# EAGLE schematic ModbusGateway4GWiFi (EAGLE 9.6.2)
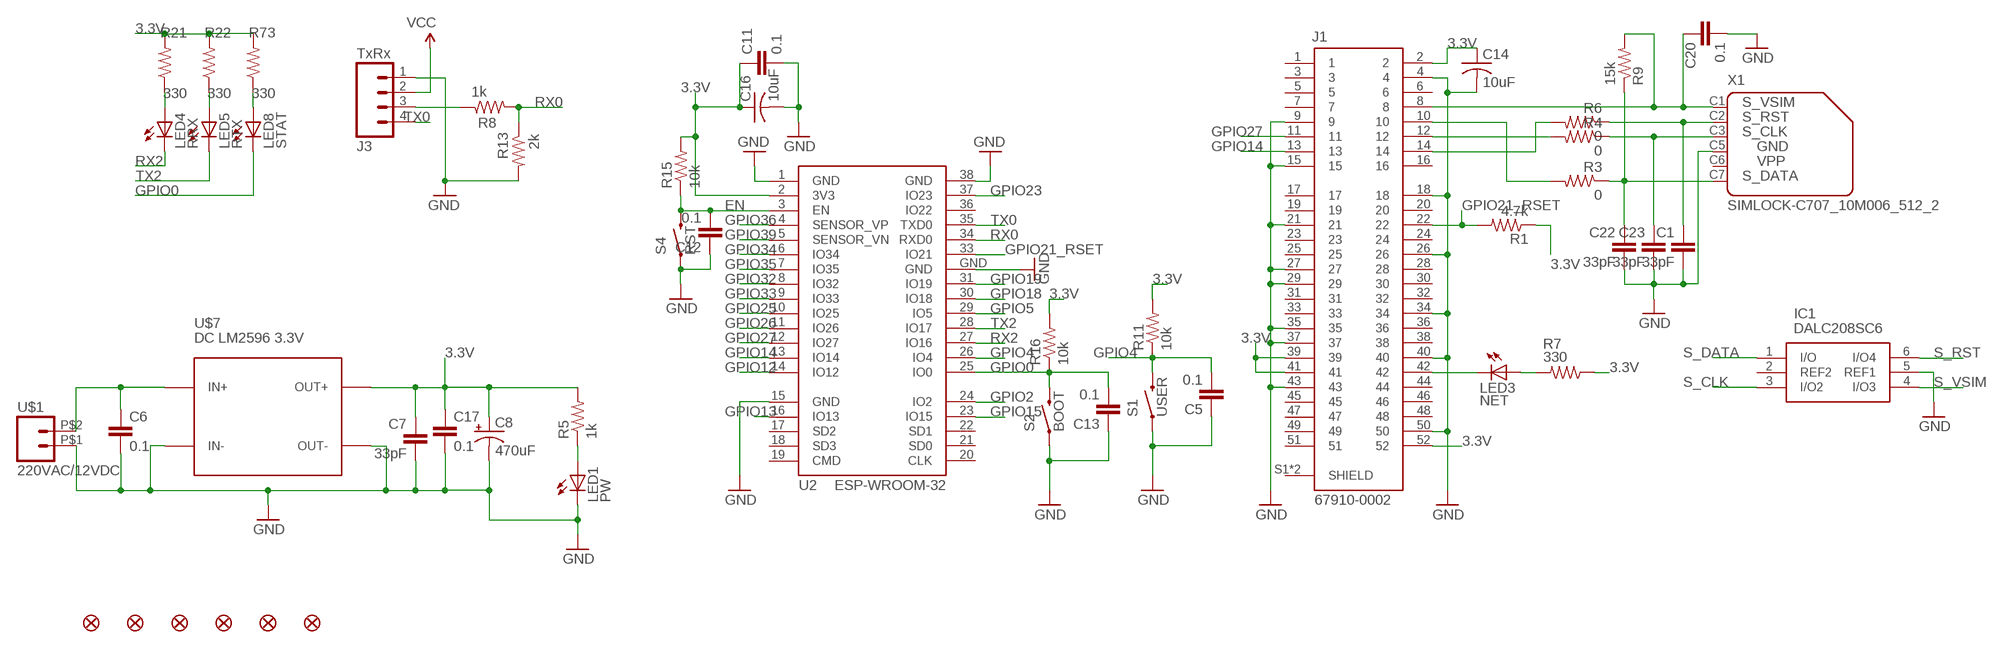
[diagram p0: schematic, sheet 1]

## Parts
C1  33pF  CAP0805  [0805]
C5  0.1  CAP0805  [0805]
C6  0.1  CAP0805  [0805]
C7  33pF  CAP0805  [0805]
C8  470uF  CPOL-US175TMP-0810  [175TMP-0810]
C11  0.1  CAP0805  [0805]
C12  0.1  CAP0805  [0805]
C13  0.1  CAP0805  [0805]
C14  10uF  C-USC1206  [C1206]
C16  10uF  C-USC1206  [C1206]
C17  0.1  CAP0805  [0805]
C20  0.1  CAP0805  [0805]
C22  33pF  CAP0805  [0805]
C23  33pF  CAP0805  [0805]
IC1  DALC208SC6  [SOT95P280X145-6N]
J1  67910-0002  [MOLEX_67910-0002]
J3  TxRx  M04POLAR  [MOLEX-1X4]
JP8  FIDUCIAL1X2  [FIDUCIAL-1X2]
JP9  FIDUCIAL1X2  [FIDUCIAL-1X2]
JP10  FIDUCIAL1X2  [FIDUCIAL-1X2]
JP11  FIDUCIAL1X2  [FIDUCIAL-1X2]
JP12  FIDUCIAL1X2  [FIDUCIAL-1X2]
JP16  FIDUCIAL1X2  [FIDUCIAL-1X2]
LED1  PW  LEDCHIP-LED0805  [CHIP-LED0805]
LED3  NET  LEDCHIP-LED0805  [CHIP-LED0805]
LED4  RRX  LEDCHIP-LED0805  [CHIP-LED0805]
LED5  RTX  LEDCHIP-LED0805  [CHIP-LED0805]
LED8  STAT  LEDCHIP-LED0805  [CHIP-LED0805]
R1  4.7k  RESISTOR0805-RES  [0805]
R3  0  RESISTOR0805-RES  [0805]
R4  0  RESISTOR0805-RES  [0805]
R5  1k  RESISTOR0805-RES  [0805]
R6  0  RESISTOR0805-RES  [0805]
R7  330  RESISTOR0805-RES  [0805]
R8  1k  RESISTOR0805-RES  [0805]
R9  15k  RESISTOR0805-RES  [0805]
R11  10k  RESISTOR0805-RES  [0805]
R13  2k  RESISTOR0805-RES  [0805]
R15  10k  RESISTOR0805-RES  [0805]
R16  10k  RESISTOR0805-RES  [0805]
R21  330  RESISTOR0805-RES  [0805]
R22  330  RESISTOR0805-RES  [0805]
R73  330  RESISTOR0805-RES  [0805]
S1  USER  SWITCH-MOMENTARY-2SMD-1101NE  [TACTILE-SWITCH-1101NE]
S2  BOOT  SWITCH-MOMENTARY-2SMD-1101NE  [TACTILE-SWITCH-1101NE]
S4  RST  SWITCH-MOMENTARY-2SMD-1101NE  [TACTILE-SWITCH-1101NE]
U2  ESP-WROOM-32  [ESP-WROOM-32]
U$1  220VAC/12VDC  5EHDRC-2P  [5EHDRC-2P]
U$7  DC LM2596 3.3V  DC-DC-STEP-DOWN-LM2596  [DC-DC-STEP-DOWN-LM2596]
X1  SIMLOCK-C707_10M006_512_2  [C707_10M006_512_2]

## Nets
3.3V: C7.1 C8.+ C11.1 C14.1 C16.1 C17.1 J1.2 J1.39 J1.41 J1.52 R1.1 R5.2 R7.1 R11.2 R15.2 R16.2 R21.2 R22.2 R73.2 U2.2(3V3) U$7.OUT+
EN: C12.2 R15.1 S4.2 U2.3(EN)
GND: C1.2 C5.1 C6.2 C7.2 C8.- C11.2 C12.1 C13.1 C14.2 C16.2 C17.2 C20.2 C22.2 C23.2 IC1.5(REF1) J1.4 J1.9 J1.15 J1.18 J1.21 J1.26 J1.27 J1.29 J1.34 J1.35 J1.37 J1.40 J1.43 J1.50 J3.1 LED1.C R13.2 S1.1 S2.1 S4.1 U2.1(GND) U2.15(GND) U2.38(GND) U2.GND U$1.P$1 U$7.IN- U$7.OUT- X1.C5
GPIO0: C13.2 LED8.C R16.1 S2.2 U2.25(IO0)
GPIO2: U2.24(IO2)
GPIO4: C5.2 R11.1 S1.2 U2.26(IO4)
GPIO5: U2.29(IO5)
GPIO12: U2.14(IO12)
GPIO13: U2.16(IO13)
GPIO14: J1.13 U2.13(IO14)
GPIO15: U2.23(IO15)
GPIO18: U2.30(IO18)
GPIO19: U2.31(IO19)
GPIO21_RSET: J1.22 R1.2 U2.33(IO21)
GPIO23: U2.37(IO23)
GPIO25: U2.10(IO25)
GPIO26: U2.11(IO26)
GPIO27: J1.11 U2.12(IO27)
GPIO32: U2.8(IO32)
GPIO33: U2.9(IO33)
GPIO34: U2.6(IO34)
GPIO35: U2.7(IO35)
GPIO36: U2.4(SENSOR_VP)
GPIO39: U2.5(SENSOR_VN)
N$1: LED1.A R5.1
N$2: C6.1 U$1.P$2 U$7.IN+
N$3: J1.10 R3.2
N$7: J1.12 R4.2
N$8: J3.3 R8.1
N$10: J1.14 R6.2
N$14: J1.42 LED3.C
N$15: LED3.A R7.2
N$48: LED4.A R21.1
N$49: LED5.A R22.1
N$54: LED8.A R73.1
RX0: R8.2 R13.1 U2.34(RXD0)
RX2: LED4.C U2.27(IO16)
S_CLK: C23.1 IC1.3(I/O2) R4.1 X1.C3
S_DATA: C22.1 IC1.1(I/O) R3.1 R9.1 X1.C7
S_RST: C1.1 IC1.6(I/O4) R6.1 X1.C2
S_VSIM: C20.1 IC1.4(I/O3) J1.8 R9.2 X1.C1
TX0: J3.4 U2.35(TXD0)
TX2: LED5.C U2.28(IO17)
VCC: J3.2
Unconnected: IC1.2(REF2) J1.1 J1.3 J1.5 J1.6 J1.7 J1.16 J1.17 J1.19 J1.20 J1.23 J1.24 J1.25 J1.28 J1.30 J1.31 J1.32 J1.33 J1.36 J1.38 J1.44 J1.45 J1.46 J1.47 J1.48 J1.49 J1.51 J1.S1(SHIELD) J1.S2(SHIELD) U2.17(SD2) U2.18(SD3) U2.19(CMD) U2.20(CLK) U2.21(SD0) U2.22(SD1) U2.36(IO22) X1.C6

## Notes on the sheet
- GND
- VPP

## Library data of the parts
C1 C5-C7 C11-C13 C17 C20 C22 C23 = SparkFun-Passives:CAP: Capacitor Standard 0603 ceramic capacitor, and 0.1" leaded capacitor.
C8 = adafruit:CPOL-US: POLARIZED CAPACITOR, American symbol
C14 C16 = adafruit:C-US: CAPACITOR, American symbol
IC1 = SamacSys_Parts:DALC208SC6: TVS Diode Array DALC208SC6 Octal, SOT-23 6-Pin Source: Datasheet <https://componentsearchengine.com/Datasheets/1/DALC208SC6.pdf>; DESCRIPTION: TVS Diode Array DALC208SC6 Octal, SOT-23 6-Pin; HEIGHT: 1.45mm; MANUFACTURER_NAME: STMicroelectronics; MANUFACTURER_PART_NUMBER: DALC208SC6; MOUSER_PART_NUMBER: 511-DALC208SC6; MOUSER_PRICE-STOCK: https://www.mouser.com/Search/Refine.aspx?Keyword=511-DALC208SC6
J1 = 67910-0002:67910-0002: 52 Position Female Connector PCI Express Mini Card Gold 0.031" (0.80mm) Black Check prices <https://pricing.snapeda.com/parts/67910-0002/Molex/view-part?ref=eda>; AVAILABILITY: Warning; DESCRIPTION: 52 Position Female Connector PCI Express Mini Card Gold 0.031 (0.80mm) Black; MF: Molex; MP: 67910-0002; PACKAGE: None; PRICE: None; PURCHASE-URL: https://pricing.snapeda.com/search/part/67910-0002/?ref=eda
J3 = SparkFun-Connectors:M04: Header 4 Standard 4-pin 0.1" header. Use with straight break away headers (SKU : PRT-00116), right angle break away headers (PRT-00553), swiss pins (PRT-00743), machine pins (PRT-00117), and female headers (PRT-00115). Molex polarized connector foot print use with SKU : PRT-08231 with associated crimp pins and housings. 1MM SMD Version SKU: PRT-10208
JP8-JP12 JP16 = SparkFun:FIDUCIAL: Fiducial Alignment Points Various fiducial points for machine vision alignment.
LED1 LED3-LED5 LED8 = led:LED: LED OSRAM: - CHIPLED LG R971, LG N971, LY N971, LG Q971, LY Q971, LO R971, LY R971 LH N974, LH R974 LS Q976, LO Q976, LY Q976 LO Q996 - Hyper CHIPLED LW Q18S LB Q993, LB Q99A, LB R99A - SideLED LS A670, LO A670, LY A670, LG A670, LP A670 LB A673, LV A673, LT A673, LW A673 LH A674 LY A675 LS A676, LA A676, LO A676, LY A676, LW A676 LS A679, LY A679, LG A679 - Hyper Micro SIDELED® LS Y876, LA Y876, LO Y876, LY Y876 LT Y87S - SmartLED LW L88C, LW L88S LB L89C, LB L89S, LG L890 LS L89K, LO L89K, LY L89K LS L896, LA L896, LO L896, LY L896 - TOPLED LS T670, LO T670, LY T670, LG T670, LP T670 LSG T670, LSP T670, LSY T670, LOP T670, LYG T670 LG T671, LOG T671, LSG T671 LB T673, LV T673, LT T673, LW T673 LH T674 LS T676, LA T676, LO T676, LY T676, LB T676, LH T676, LSB T676, LW T676 LB T67C, LV T67C, LT T67C, LS T67K, LO T67K, LY T67K, LW E67C LS E67B, LA E67B, LO E67B, LY E67B, LB E67C, LV E67C, LT E67C LW T67C LS T679, LY T679, LG T679 LS T770, LO T770, LY T770, LG T770, LP T770 LB T773, LV T773, LT T773, LW T773 LH T774 LS E675, LA E675, LY E675, LS T675 LS T776, LA T776, LO T776, LY T776, LB T776 LHGB T686 LT T68C, LB T68C - Hyper Mini TOPLED® LB M676 - Mini TOPLED Santana® LG M470 LS M47K, LO M47K, LY M47K Source: http://www.osram.convergy.de LUXEON: - LUMILED® LXK2-PW12-R00, LXK2-PW12-S00, LXK2-PW14-U00, LXK2-PW14-V00 LXK2-PM12-R00, LXK2-PM12-S00, LXK2-PM14-U00 LXK2-PE12-Q00, LXK2-PE12-R00, LXK2-PE12-S00, LXK2-PE14-T00, LXK2-PE14-U00 LXK2-PB12-K00, LXK2-PB12-L00, LXK2-PB12-M00, LXK2-PB14-N00, LXK2-PB14-P00, LXK2-PB14-Q00 LXK2-PR12-L00, LXK2-PR12-M00, LXK2-PR14-Q00, LXK2-PR14-R00 LXK2-PD12-Q00, LXK2-PD12-R00, LXK2-PD12-S00 LXK2-PH12-R00, LXK2-PH12-S00 LXK2-PL12-P00, LXK2-PL12-Q00, LXK2-PL12-R00 Source: www.luxeon.com KINGBRIGHT: KA-3528ASYC Source: www.kingbright.com
R1 R3-R9 R11 R13 R15 R16 R21 R22 R73 = SparkFun-Resistors:RESISTOR: Resistor Basic schematic elements and footprints for 0603, 1206, and PTH resistors.
S1 S2 S4 = SparkFun-Electromechanical:SWITCH-MOMENTARY-2: Various NO switches- pushbuttons, reed, etc; PROD_ID: SWCH-00815
U2 = esp32:ESP-WROOM-32: Espressif Systems ESP-WROOM-32
U$1 = ES-CONNECTOR:5EHDRC-2P
U$7 = diy-modules:DC-DC-STEP-DOWN-LM2596: DC/DC Step-Down Regulator based on LM2596-ADJ chip LM2596 datasheet available here: http://www.ti.com/lit/ds/symlink/lm2596.pdf Click here to find device on ebay.com <http://www.ebay.com/sch/lm2596+power+regulator>
X1 = con-amphenol:SIMLOCK-C707_10M006_512_2: C707A SIMLOCK® 2.5 mm with wide solder tails Source: Data sheet <http://www.amphenol.info/downloads/C707_10M006_512_2.pdf>; OC_FARNELL: unknown; OC_NEWARK: unknown